# EAGLE design LCD BackPack wider one sided (EAGLE 9.5.2)
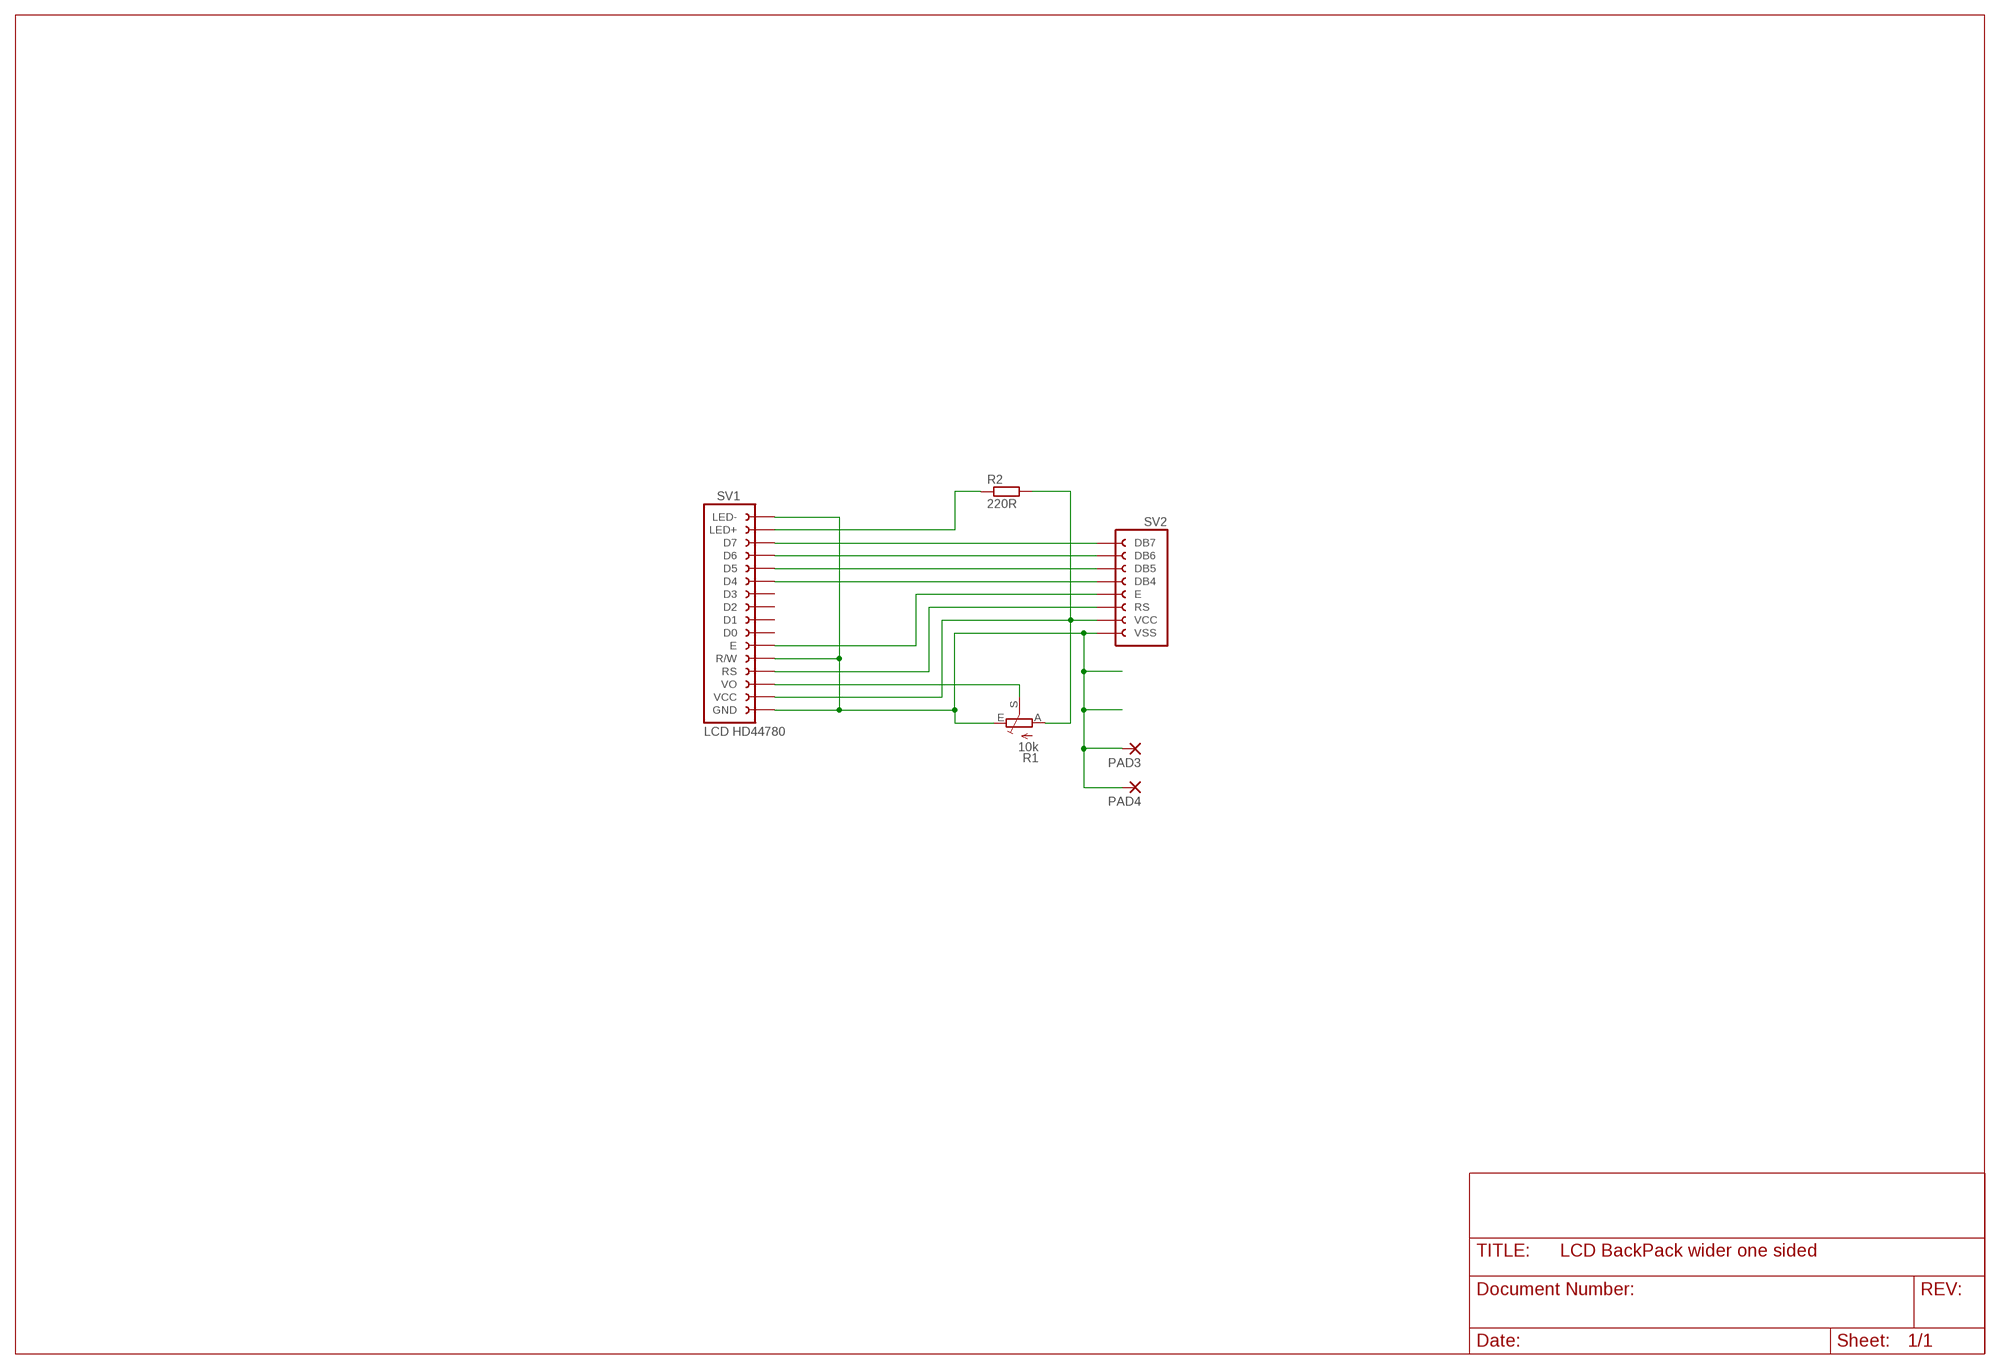
[diagram p0: schematic, sheet 1]

## Parts
PAD3  1,6/0,8  [1,6/0,8]
PAD4  1,6/0,8  [1,6/0,8]
R1  10k  POTENTIOMETER_CA6VCA6V  [CA6V]
R2  220R  R-EU_0204/7  [0204/7]
SV1  LCD-HD44780-16-PIN_FEMALE_HEADER  [LCD-HD44780-16-PIN_FEMALE_HEADER]
SV2  LCD-CONTROL_8-PIN_FEMALE_HEADER  [LCD-CONTROL_8-PIN_FEMALE_HEADER]

## Nets
DB4: SV1.D4 SV2.DB4
DB5: SV1.D5 SV2.DB5
DB6: SV1.D6 SV2.DB6
DB7: SV1.D7 SV2.DB7
E: SV1.E SV2.E
GND [My20]: PAD3.1(P) PAD4.1(P) R1.E SV1.GND SV1.LED- SV1.R/W SV2.VSS
LED+ [My20]: R2.1 SV1.LED+
N$10: R1.S SV1.VO
RS: SV1.RS SV2.RS
VCC [My20]: R1.A R2.2 SV1.VCC SV2.VCC
Unconnected: SV1.D0 SV1.D1 SV1.D2 SV1.D3

## Library data of the parts
PAD3 PAD4 = wirepad:1,6/0,8: THROUGH-HOLE PAD
R1 = myLib-04-OftenUsed:POTENTIOMETER_CA6V: TRIM POTENTIOMETER Trim Potentiometer CA6V
R2 = resistor:R-EU_: RESISTOR, European symbol
SV1 = myLib-01-Headers:LCD-HD44780-16-PIN_FEMALE_HEADER: Header for the 16 pin HD44780 LCD module Female; OC_FARNELL: unknown; OC_NEWARK: unknown
SV2 = myLib-01-Headers:LCD-CONTROL_8-PIN_FEMALE_HEADER: LCD-Control 8-pin FEMALE HEADER

## Net classes
0 default: width 0.127 mm
1 My20: width 0.508 mm, clearance 0.254 mm

## Board
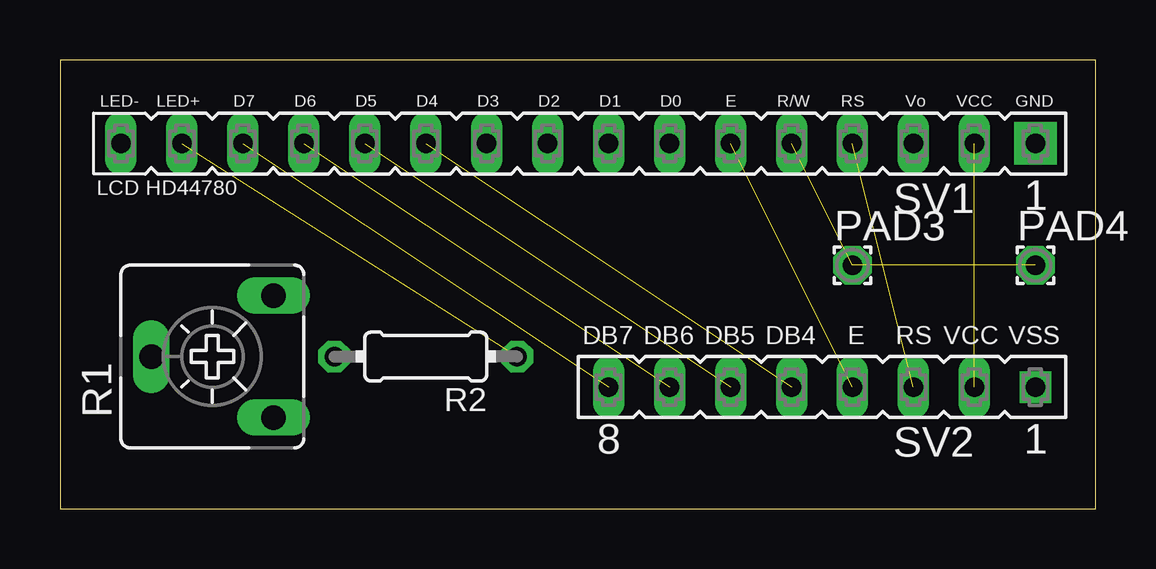
[diagram p1: board, top side]
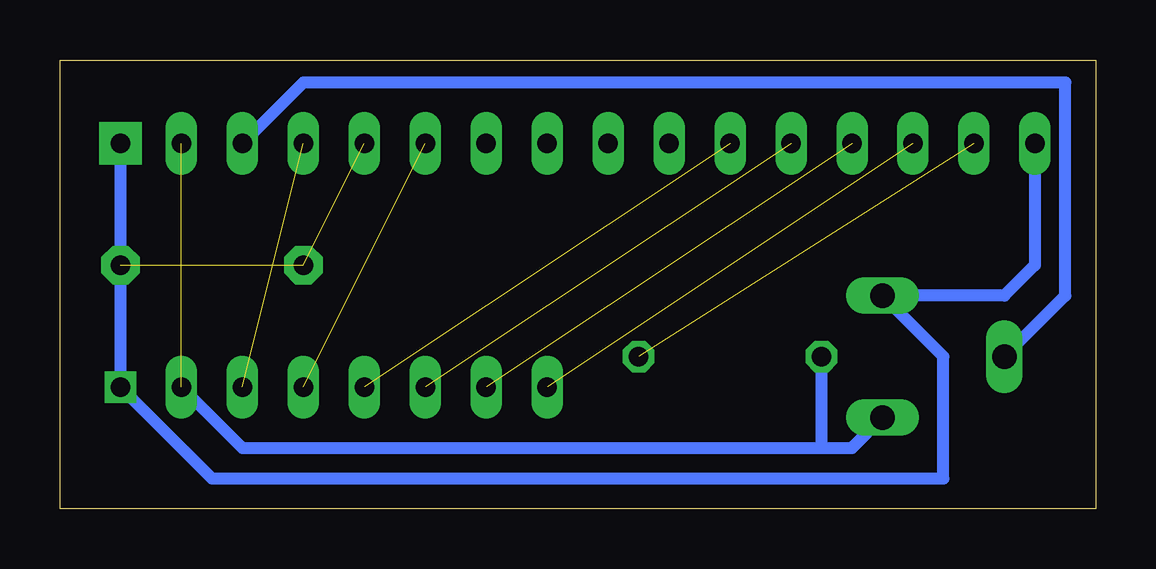
[diagram p2: board, bottom side, seen from below]

Size 43.16 x 18.72 mm. Coordinates in mm from the lower left corner, seen from the top.
Outline: 0,0 43.16,0 43.16,18.72 0,18.72 0,0
Copper layers (1*16): Top 0.035mm / dielectric 1.5mm / Bottom 0.035mm
Design rules "default *": minimum track width 6mil, minimum drill 0.35mm, track to track 6mil, track to pad 6mil, pad to pad 6mil, via to via 6mil, smd to smd 6mil, copper to edge 6mil, drill to drill 6mil, minimum pad ring 10mil, minimum via ring 8mil, stop-mask expansion 4mil, vias tented up to drill 0mil, thermal gap 10mil

### Footprints (pad centres in the part's own frame; a part is rotated, then mirrored left to right if it is on the bottom)
1,6/0,8 = drill 0.813 pad 1.6 octagon: 1 0,0
CA6V = drill 1.016 long: A -2.54,-2.54; E 2.54,-2.54; S 0,2.54
0204/7 = drill 0.813 octagon: 1 -3.81,0; 2 3.81,0
LCD-HD44780-16-PIN_FEMALE_HEADER = drill 0.813 long: D0 15.24,0; D1 17.78,0; D2 20.32,0; D3 22.86,0; D4 25.4,0; D5 27.94,0; D6 30.48,0; D7 33.02,0; E 12.7,0; LED+ 35.56,0; LED- 38.1,0; R/W 10.16,0; RS 7.62,0; VCC 2.54,0; VO 5.08,0 | drill 0.813 pad 1.778 square: GND 0,0
LCD-CONTROL_8-PIN_FEMALE_HEADER = drill 0.813 long: DB4 10.16,0; DB5 12.7,0; DB6 15.24,0; DB7 17.78,0; E 7.62,0; RS 5.08,0; VCC 2.54,0 | drill 0.813 square: VSS 0,0

### Placement (x,y rotation side)
PAD3  33.02,10.16 0 top
PAD4  40.64,10.16 0 top
R1  6.35,6.35 90 top
R2  15.24,6.35 180 top
SV1  40.64,15.24 180 top
SV2  40.64,5.08 180 top

### Tracks (layer width: path | path; a pad name or v marks a point on that pad's centre or on a via)
DB4  (1 unrouted)
DB5  (1 unrouted)
DB6  (1 unrouted)
DB7  (1 unrouted)
E  (1 unrouted)
GND  (2 unrouted)
  Bottom 0.508: SV1.GND PAD4.1 SV2.VSS 36.83,1.27 6.35,1.27 6.35,6.35 R1.E 3.81,8.89 2.54,10.16 SV1.LED-
LED+  (1 unrouted)
N$10
  Bottom 0.508: R1.S 1.27,8.89 1.27,17.78 33.02,17.78 SV1.VO
RS  (1 unrouted)
VCC  (1 unrouted)
  Bottom 0.508: SV2.VCC 35.56,2.54 11.43,2.54 | 11.43,2.54 R2.2 | 11.43,2.54 10.16,2.54 R1.A